# Altium schematic sheet Cabling, Bench Tester, Mirror Cell Controller.SchDoc
size B; PageSetup: Record=PageOptions|CenterHorizontal=True|CenterVertical=True|PrintScale=1.09|XCorrection=1.00|YCorrection=1.00|PrintKind=0|BorderSize=5000000|LeftOffset=0|BottomOffset=0|Orientation=2|PaperLength=1000|PaperWidth=1000|Scale=100|PaperSource=7|PrintQuality=-4|MediaType=1|DitherType=10|PaperKind=Tabloid 11 x 17in|PrintScaleMode=1
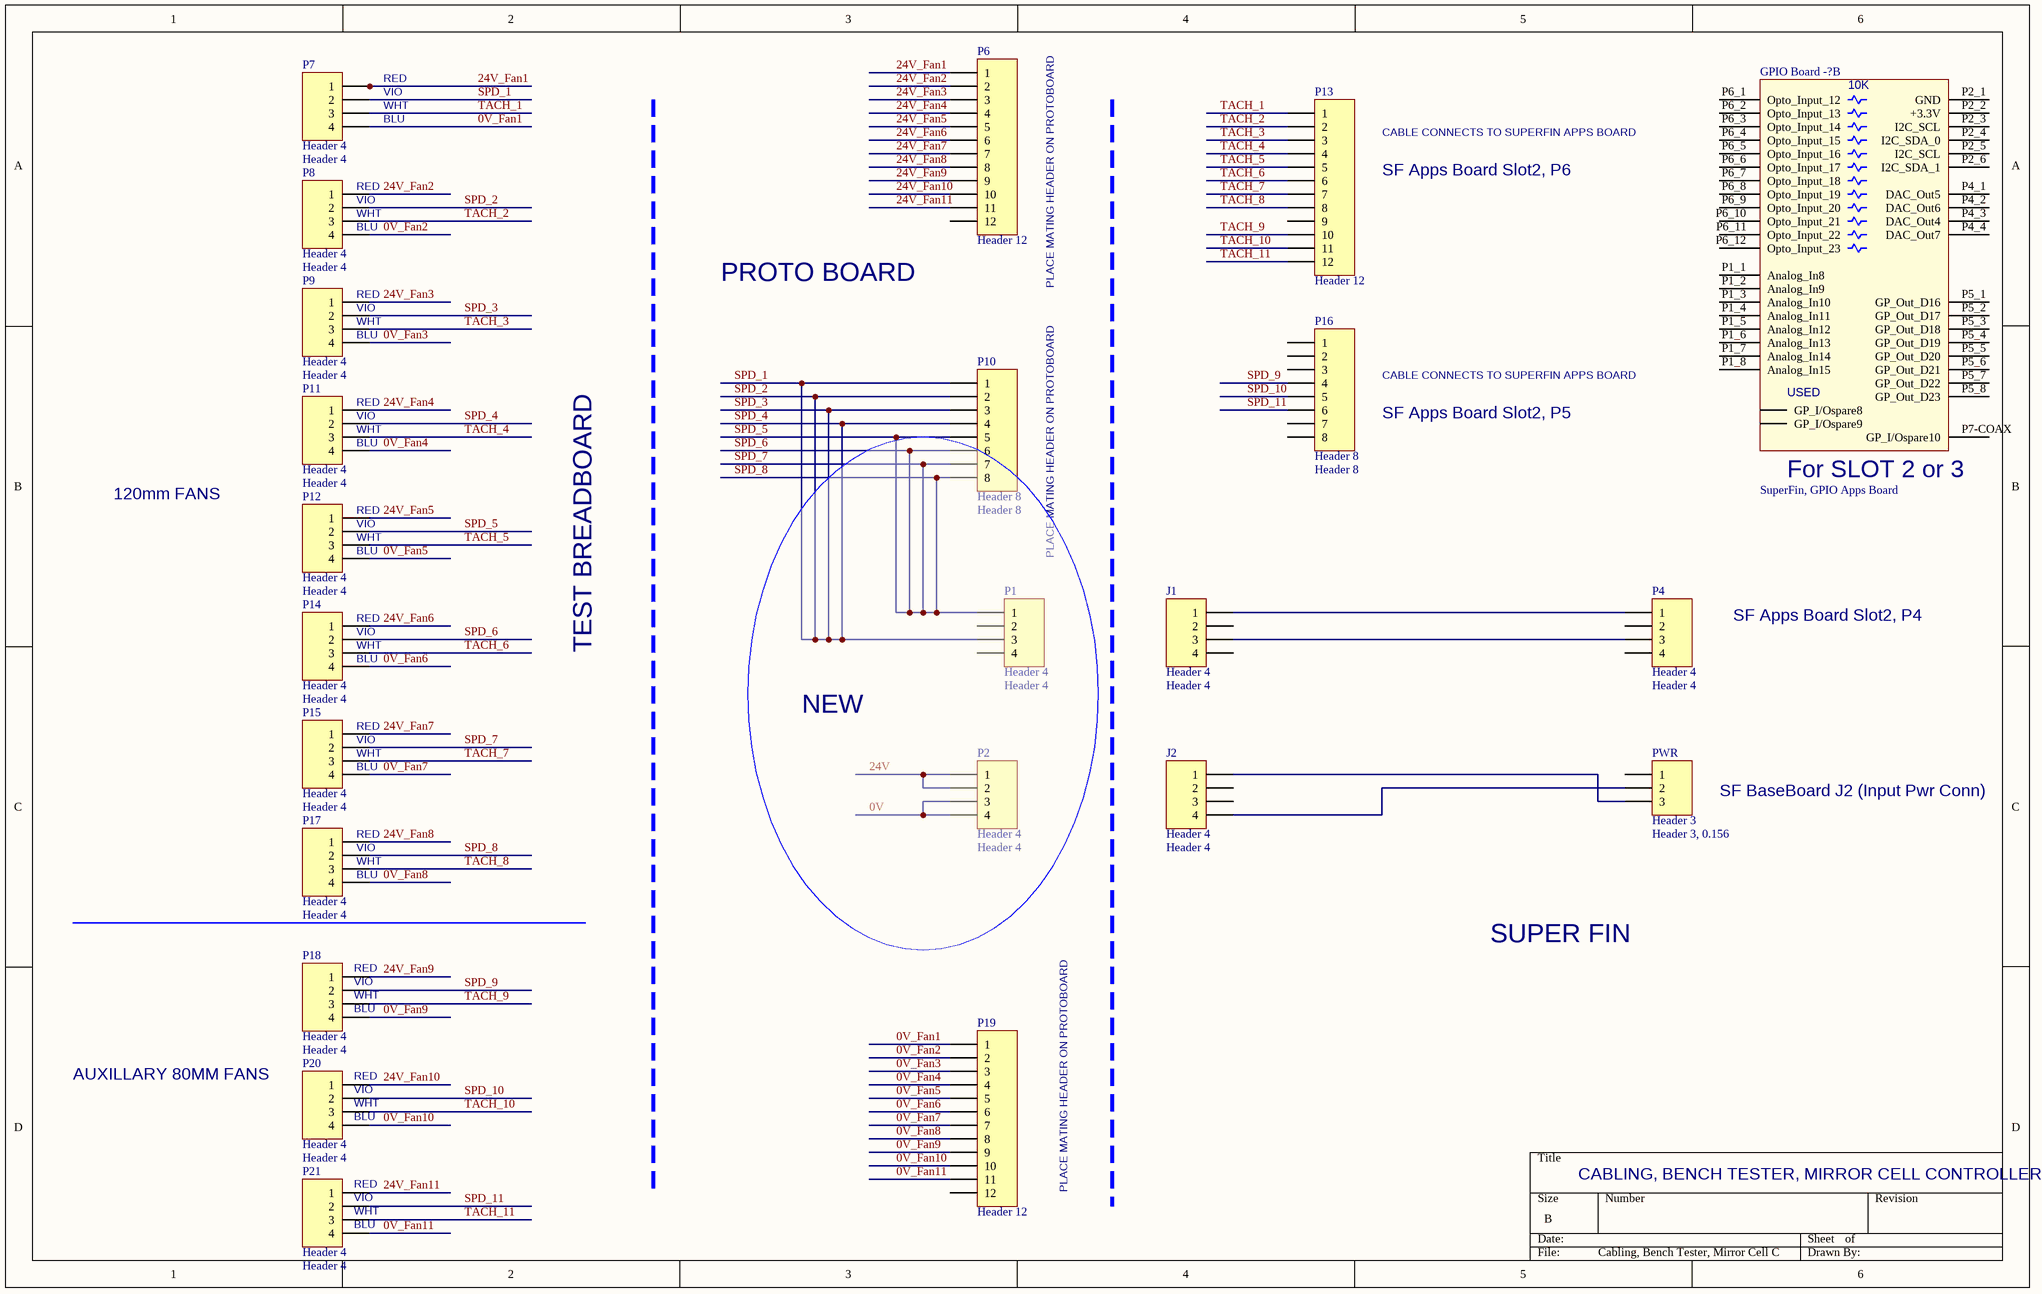
[diagram p0: Cabling, Bench Tester, Mirror Cell Controller.SchDoc]

## Parts
GPIO_Board_-?  SuperFin, GPIO Apps Board  (part B of 2)
J1  Header 4  [HDR1X4 for IDC]
J2  Header 4  [HDR1X4 for IDC]
P1  Header 4  [HDR1X4 for IDC]
P2  Header 4  [HDR1X4 for IDC]
P4  Header 4  [HDR1X4 for IDC]
P6  Header 12  [HDR1X12 for IDC]
P7  Header 4  [HDR1X4 for IDC]
P8  Header 4  [HDR1X4 for IDC]
P9  Header 4  [HDR1X4 for IDC]
P10  Header 8  [HDR1X8 for IDC]
P11  Header 4  [HDR1X4 for IDC]
P12  Header 4  [HDR1X4 for IDC]
P13  Header 12  [HDR1X12 for IDC]
P14  Header 4  [HDR1X4 for IDC]
P15  Header 4  [HDR1X4 for IDC]
P16  Header 8  [HDR1X8 for IDC]
P17  Header 4  [HDR1X4 for IDC]
P18  Header 4  [HDR1X4 for IDC]
P19  Header 12  [HDR1X12 for IDC]
P20  Header 4  [HDR1X4 for IDC]
P21  Header 4  [HDR1X4 for IDC]
PWR  Header 3  value Header 3, 0.156  [HDR 1X3 0.156"]

## Nets
0V: P2.3 P2.4
0V_Fan1: P7.4 P19.1
0V_Fan2: P8.4 P19.2
0V_Fan3: P9.4 P19.3
0V_Fan4: P11.4 P19.4
0V_Fan5: P12.4 P19.5
0V_Fan6: P14.4 P19.6
0V_Fan7: P15.4 P19.7
0V_Fan8: P17.4 P19.8
0V_Fan9: P18.4 P19.9
0V_Fan10: P19.10 P20.4
0V_Fan11: P19.11 P21.4
24V: P2.1 P2.2
24V_Fan1: P6.1 P7.1
24V_Fan2: P6.2 P8.1
24V_Fan3: P6.3 P9.1
24V_Fan4: P6.4 P11.1
24V_Fan5: P6.5 P12.1
24V_Fan6: P6.6 P14.1
24V_Fan7: P6.7 P15.1
24V_Fan8: P6.8 P17.1
24V_Fan9: P6.9 P18.1
24V_Fan10: P6.10 P20.1
24V_Fan11: P6.11 P21.1
SPD_1: P1.3 P7.2 P8.2 P9.2 P10.1 P10.2 P10.3 P10.4 P11.2  [also labelled SPD_2, SPD_3, SPD_4]
SPD_5: P1.1 P10.5 P10.6 P10.7 P10.8 P12.2 P14.2 P15.2 P17.2  [also labelled SPD_6, SPD_7, SPD_8]
SPD_9: P16.4 P18.2
SPD_10: P16.5 P20.2
SPD_11: P16.6 P21.2
TACH_1: P7.3 P13.1
TACH_2: P8.3 P13.2
TACH_3: P9.3 P13.3
TACH_4: P11.3 P13.4
TACH_5: P12.3 P13.5
TACH_6: P13.6 P14.3
TACH_7: P13.7 P15.3
TACH_8: P13.8 P17.3
TACH_9: P13.10 P18.3
TACH_10: P13.11 P20.3
TACH_11: P13.12 P21.3
NetJ1_1: J1.1 P4.1
NetJ1_3: J1.3 P4.3
NetJ2_1: J2.1 PWR.3
NetJ2_4: J2.4 PWR.2

Not connected (* = marked no-connect by the designer): GPIO_Board_-? 0(GP_I/Ospare9) P1_1(Analog_In8) P1_2(Analog_In9) P1_3(Analog_In10) P1_4(Analog_In11) P1_5(Analog_In12) P1_6(Analog_In13) P1_7(Analog_In14) P1_8(Analog_In15) P2_1(GND) P2_2(+3.3V) P2_3(I2C_SCL) P2_4(I2C_SDA_0) P2_5(I2C_SCL) P2_6(I2C_SDA_1) P4_1(DAC_Out5) P4_2(DAC_Out6) P4_3(DAC_Out4) P4_4(DAC_Out7) P5_1(GP_Out_D16) P5_2(GP_Out_D17) P5_3(GP_Out_D18) P5_4(GP_Out_D19) P5_5(GP_Out_D20) P5_6(GP_Out_D21) P5_7(GP_Out_D22) P5_8(GP_Out_D23) P6_1(Opto_Input_12) P6_2(Opto_Input_13) P6_3(Opto_Input_14) P6_4(Opto_Input_15) P6_5(Opto_Input_16) P6_6(Opto_Input_17) P6_7(Opto_Input_18) P6_8(Opto_Input_19) P6_9(Opto_Input_20) P6_10(Opto_Input_21) P6_11(Opto_Input_22) P6_12(Opto_Input_23) P7-COAX(GP_I/Ospare10); J1 2 4; J2 2 3; P1 2 4; P4 2 4; P6 12; P13 9; P16 1 2 3 7 8; P19 12; PWR 1

## Notes on the sheet
- (near P7) RED
- (near P7) VIO
- (near P7) BLU
- (near P7) WHT
- CABLE CONNECTS TO SUPERFIN APPS BOARD
- (near P8) RED
- (near P8) BLU
- (near P8) WHT
- (near P8) VIO
- SF Apps Board Slot2, P6
- (near P9) RED
- PROTO BOARD
- PLACE MATING HEADER ON PROTOBOARD
- (near P9) BLU
- (near P9) WHT
- (near P9) VIO
- (near P11) RED
- (near P11) WHT
- (near P11) VIO
- SF Apps Board Slot2, P5
- 120mm FANS
- (near P11) BLU
- (near P12) RED
- (near P12) BLU
- (near P12) WHT
- (near P12) VIO
- (near P14) RED
- (near P14) VIO
- SF Apps Board Slot2, P4
- (near P14) BLU
- (near P14) WHT
- TEST BREADBOARD
- (near P15) RED
- (near P15) BLU
- (near P15) WHT
- (near P15) VIO
- NEW
- (near P17) RED
- SF BaseBoard J2 (Input Pwr Conn)
- (near P17) BLU
- (near P17) WHT
- (near P17) VIO
- (near P18) RED
- SUPER FIN
- (near P18) BLU
- (near P18) WHT
- (near P18) VIO
- AUXILLARY 80MM FANS
- (near P20) RED
- (near P20) WHT
- (near P20) VIO
- (near P20) BLU
- CABLING, BENCH TESTER, MIRROR CELL CONTROLLER
- (near P21) RED
- (near P21) BLU
- (near P21) WHT
- (near P21) VIO
- (in symbol SuperFin, GPIO Apps Board, part B) 10K; USED; For SLOT 2 or 3

## Library data of the parts
J1 J2 P1 P2 P4 P7-P9 P11 P12 P14 P15 P17 P18 P20 P21 = Header 4: Header, 4-Pin; LCO p/n: 125-00037; VALUE: Header 4
P6 P13 P19 = Header 12: Header, 12-Pin; Manufacturer: Tyco; Manuf p/n: 1-640456-2; Vendor: Digi-Key; Vendor p/n: A19475-ND; LCO p/n: XXXXXX; COST: 0.57; VALUE: Header 12
P10 P16 = Header 8: Header, 8-Pin; VALUE: Header 8
PWR = Header 3, 0.156: Header, 3-Pin, 0.156; LCO p/n: 125-00083